# Altium schematic sheet HW_Mechanical_Parts.SchDoc: HW Mechanical parts
size A4; Date: 19/04/2016; Author: N.P; CompanyName: STMicroelectronics; Organization: MCD/APPLIS/LMS; DocumentNumber: MB1260; SheetNumber: 13; SheetTotal: 13; Project: STM32F723e-DISCO
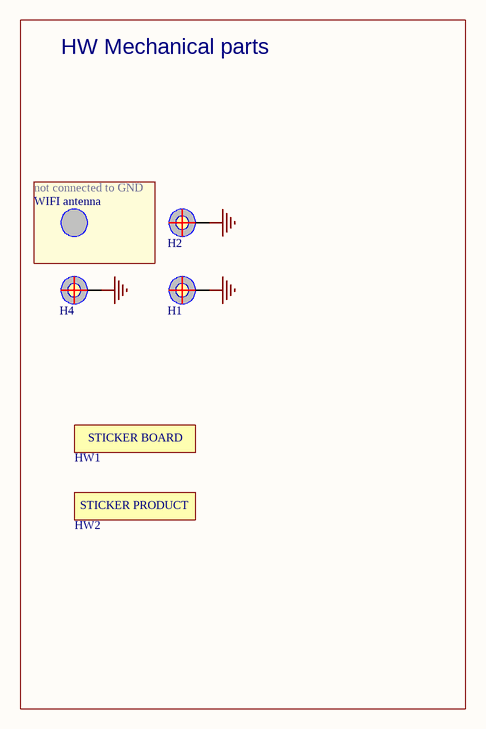
[diagram p0: HW_Mechanical_Parts.SchDoc]

## Parts
H1  POSITION HOLE C6D3R5  [HOLE_C6D3R5]  (value not drawn)  (no BOM)
H2  POSITION HOLE C6D3R5  [HOLE_C6D3R5]  (value not drawn)  (no BOM)
H4  POSITION HOLE C6D3R5  [HOLE_C6D3R5]  (value not drawn)  (no BOM)
HW1  STICKER_BOARD  (value not drawn)  (no BOM)
HW2  STICKER_PRODUCT  (value not drawn)  (no BOM)

## Nets
GND: H1.1 H2.1 H4.1

## Notes on the sheet
- HW Mechanical parts
- (near H2) not connected to GND
- WIFI antenna
- Title:
- Project:
- Size:
- Revision:
- Variant:
- A4
- -
- Date:
- Reference:
- Sheet:
- of
- (in symbol STICKER_BOARD) STICKER BOARD
- (in symbol STICKER_PRODUCT) STICKER PRODUCT

## Library data of the parts
H1 H2 H4 = POSITION HOLE C6D3R5: Fitted: NO; Ordered by: Subcon; ECCN_US/EU: n/a